# EAGLE design Brigid_control_board_v1 (EAGLE 9.6.2)
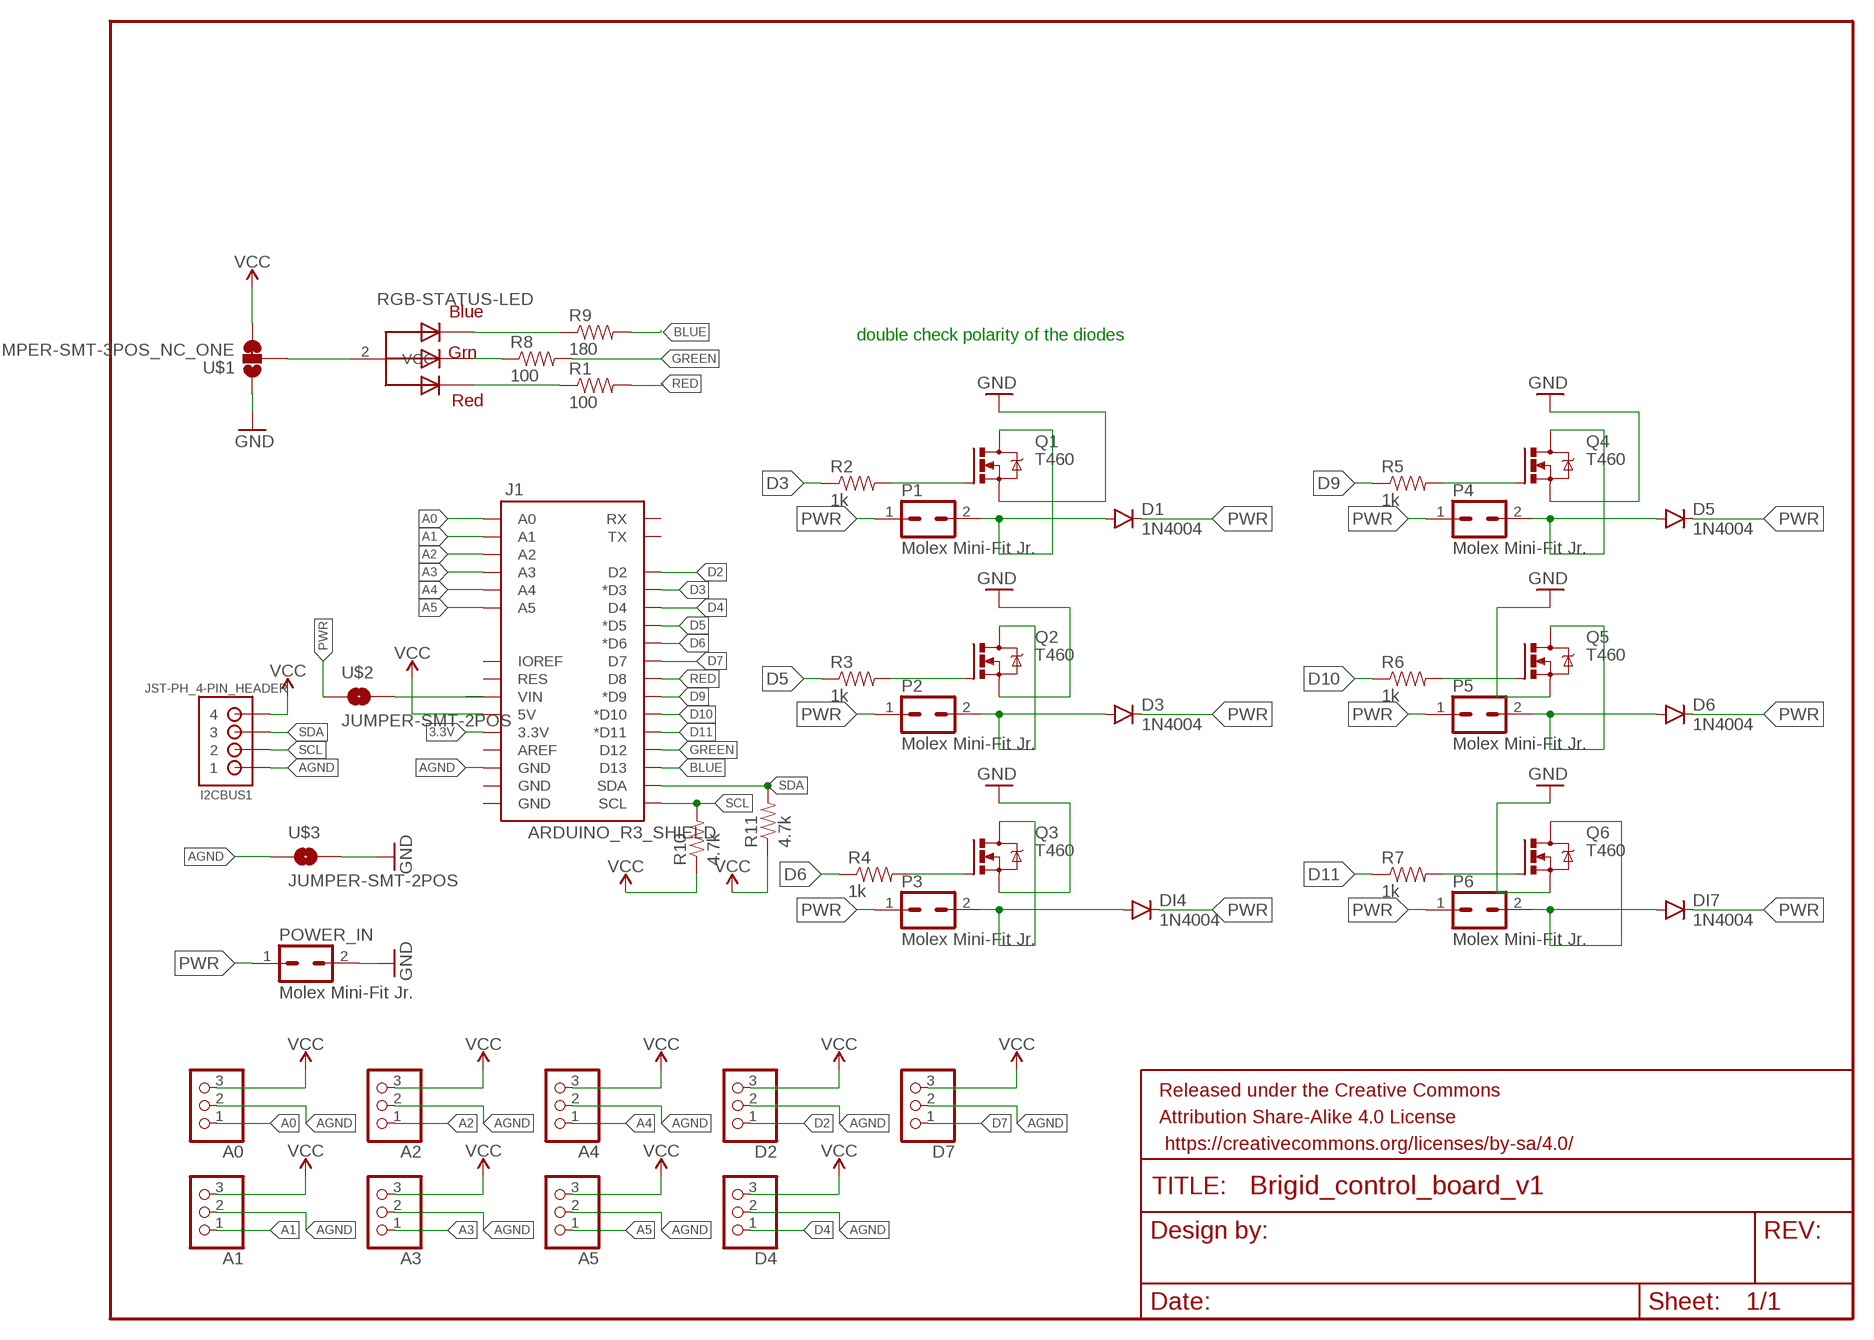
[diagram p0: schematic, sheet 1]

## Parts
A0  PINHD-1X3  [1X03]
A1  PINHD-1X3  [1X03]
A2  PINHD-1X3  [1X03]
A3  PINHD-1X3  [1X03]
A4  PINHD-1X3  [1X03]
A5  PINHD-1X3  [1X03]
D1  1N4004  DIODEPTH  [DIODE-1N4001]
D2  PINHD-1X3  [1X03]
D3  1N4004  DIODEPTH  [DIODE-1N4001]
D4  PINHD-1X3  [1X03]
D5  1N4004  DIODEPTH  [DIODE-1N4001]
D6  1N4004  DIODEPTH  [DIODE-1N4001]
D7  PINHD-1X3  [1X03]
DI4  1N4004  DIODEPTH  [DIODE-1N4001]
DI7  1N4004  DIODEPTH  [DIODE-1N4001]
FRAME1  FRAME-LETTER  [CREATIVE_COMMONS]
I2CBUS1  JST-PH_4-PIN_HEADER  [JST_B4B-PH_HEADER]
J1  ARDUINO_R3_SHIELD  [UNO_R3_SHIELD]
P1  Molex Mini-Fit Jr.  39-30-02  [39-30-?02?]
P2  Molex Mini-Fit Jr.  39-30-02  [39-30-?02?]
P3  Molex Mini-Fit Jr.  39-30-02  [39-30-?02?]
P4  Molex Mini-Fit Jr.  39-30-02  [39-30-?02?]
P5  Molex Mini-Fit Jr.  39-30-02  [39-30-?02?]
P6  Molex Mini-Fit Jr.  39-30-02  [39-30-?02?]
POWER_IN  Molex Mini-Fit Jr.  39-30-02  [39-30-?02?]
Q1  T460  IRF540  [TO220BV]
Q2  T460  IRF540  [TO220BV]
Q3  T460  IRF540  [TO220BV]
Q4  T460  IRF540  [TO220BV]
Q5  T460  IRF540  [TO220BV]
Q6  T460  IRF540  [TO220BV]
R1  100  RESISTOREZ  [AXIAL-0.3EZ]
R2  1k  RESISTOREZ  [AXIAL-0.3EZ]
R3  1k  RESISTOREZ  [AXIAL-0.3EZ]
R4  1k  RESISTOREZ  [AXIAL-0.3EZ]
R5  1k  RESISTOREZ  [AXIAL-0.3EZ]
R6  1k  RESISTOREZ  [AXIAL-0.3EZ]
R7  1k  RESISTOREZ  [AXIAL-0.3EZ]
R8  100  RESISTOREZ  [AXIAL-0.3EZ]
R9  180  RESISTOREZ  [AXIAL-0.3EZ]
R10  4.7k  RESISTOREZ  [AXIAL-0.3EZ]
R11  4.7k  RESISTOREZ  [AXIAL-0.3EZ]
RGB-STATUS-LED  RGB LED  RGBLED_CA  [LED5MMRGB]
U$1  JUMPER-SMT-3POS_NC_ONE  [SMT-JUMPER_3_1-NC_TRACE_NO-SILK]
U$2  JUMPER-SMT-2POS  [SMT-JUMPER_2_NO_NO-SILK]
U$3  JUMPER-SMT-2POS  [SMT-JUMPER_2_NO_NO-SILK]

## Nets
3.3V: J1.3.3V
A0: A0.1 J1.A0
A1: A1.1 J1.A1
A2: A2.1 J1.A2
A3: A3.1 J1.A3
A4: A4.1 J1.A4
A5: A5.1 J1.A5
AGND: A0.2 A1.2 A2.2 A3.2 A4.2 A5.2 D2.2 D4.2 D7.2 I2CBUS1.P1 J1.GND@2(GND) U$3.1
BLUE: J1.D13 R9.P$2
D2: D2.1 J1.D2
D3: J1.D3(*D3) R2.P$1
D4: D4.1 J1.D4
D5: J1.D5(*D5) R3.P$1
D6: J1.D6(*D6) R4.P$1
D7: D7.1 J1.D7
D9: J1.D9(*D9) R5.P$1
D10: J1.D10(*D10) R6.P$1
D11: J1.D11(*D11) R7.P$1
GND: POWER_IN.2 Q1.S Q2.S Q3.S Q4.S Q5.S Q6.S U$1.1 U$3.2
GREEN: J1.D12 R8.P$2
N$3: D1.A P1.2 Q1.D
N$5: R9.P$1 RGB-STATUS-LED.4(BLUE)
N$6: RGB-STATUS-LED.2(VCC) U$1.2
N$7: R1.P$1 RGB-STATUS-LED.1(RED)
N$8: R8.P$1 RGB-STATUS-LED.3(GREEN)
N$9: Q2.G R3.P$2
N$10: D3.A P2.2 Q2.D
N$11: Q1.G R2.P$2
N$12: Q3.G R4.P$2
N$13: DI4.A P3.2 Q3.D
N$15: Q4.G R5.P$2
N$16: D5.A P4.2 Q4.D
N$18: Q5.G R6.P$2
N$19: D6.A P5.2 Q5.D
N$21: Q6.G R7.P$2
N$22: DI7.A P6.2 Q6.D
PWR: D1.C D3.C D5.C D6.C DI4.C DI7.C P1.1 P2.1 P3.1 P4.1 P5.1 P6.1 POWER_IN.1 U$2.1
RED: J1.D8 R1.P$2
SCL: I2CBUS1.P2 J1.SCL R10.P$2
SDA: I2CBUS1.P3 J1.SDA R11.P$2
VCC: A0.3 A1.3 A2.3 A3.3 A4.3 A5.3 D2.3 D4.3 D7.3 I2CBUS1.P4 J1.5V R10.P$1 R11.P$1 U$1.3
VIN: J1.VIN U$2.2
Unconnected: J1.AREF J1.GND@0(GND) J1.GND@1(GND) J1.IOREF J1.RES J1.RX J1.TX

## Notes on the sheet
- double check polarity of the diodes

## Library data of the parts
A0 A1-A5 D2 D4 D7 = Connector:PINHD-1X3: PIN HEADER; CATEGORY: CONNECTOR; SUB-CATEGORY: PIN-HEADER
D1 D3 D5 D6 DI4 DI7 = SparkFun-DiscreteSemi:DIODE: Diode These are standard reverse protection diodes and small signal diodes. SMA package can handle up to about 1A. SOD-323 can handle about 200mA. What the SOD-323 package when ordering, there are some mfgs out there that are 5-pin packages.
FRAME1 = SparkFun-Aesthetics:FRAME-LETTER: Schematic Frame Standard 8.5x11 US Letter frame
I2CBUS1 = JST_connectors:JST-PH_4-PIN_HEADER: 4-pin JST PH Shrouded Header, top entry P/N B4B-PH-K-S Mating connector PHR-4 Mating cable assembly: Sparkfun PRT-09916 <http://www.sparkfun.com/products/9916>
J1 = Nathans-Arduinos2:ARDUINO_R3_SHIELD: Shield form compatible with the Arduino Uno R3.
P1-P6 POWER_IN = con-molex-mini-fit:39-30-?02?: HEADER
Q1-Q6 = transistor-power:IRF540: HEXFET Power MOSFET
R1-R11 = SparkFun-Passives:RESISTOR: Resistor Basic schematic elements and footprints for 0603, 1206, and PTH resistors.
RGB-STATUS-LED = adafruit:RGBLED_CA: RGB LED, common-anode Staggered pins http://www.ladyada.net/library/pcb/eaglelibrary.html
U$1 = nathans-custom-parts:JUMPER-SMT-3POS_NC_ONE
U$2 U$3 = nathans-custom-parts:JUMPER-SMT-2POS

## Net classes
0 default: width 0.152 mm, drill 0.305 mm, clearance 0.152 mm

## Board
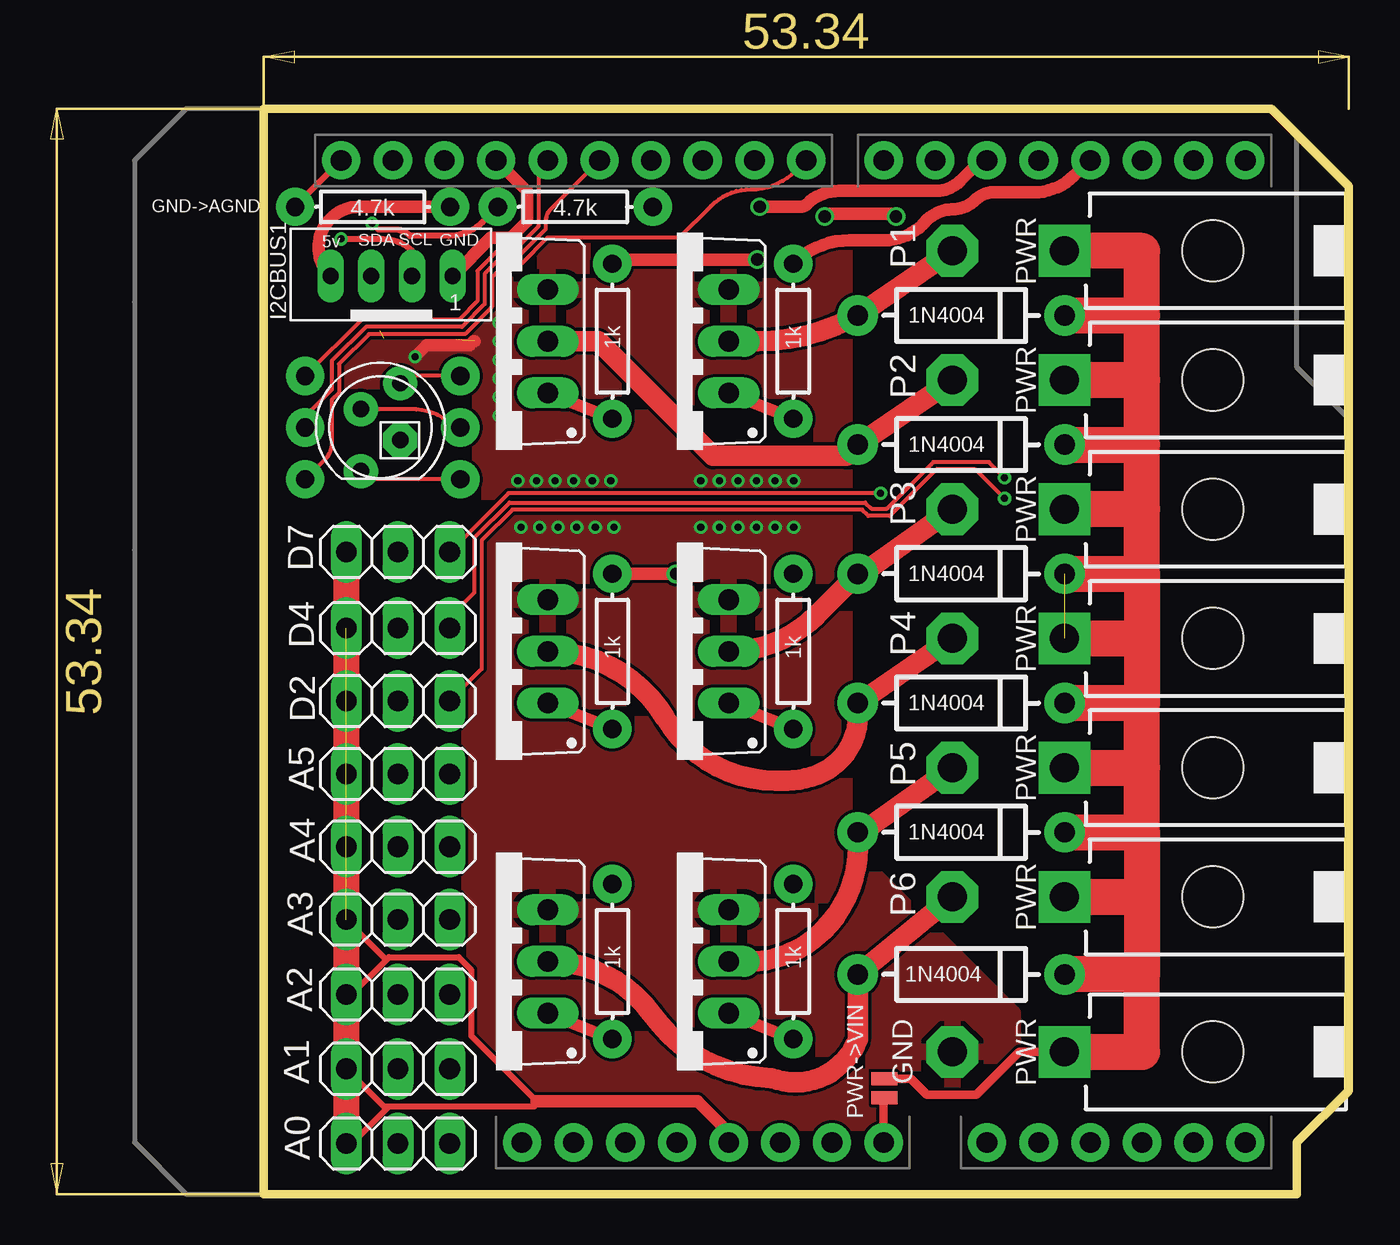
[diagram p1: board, top side]
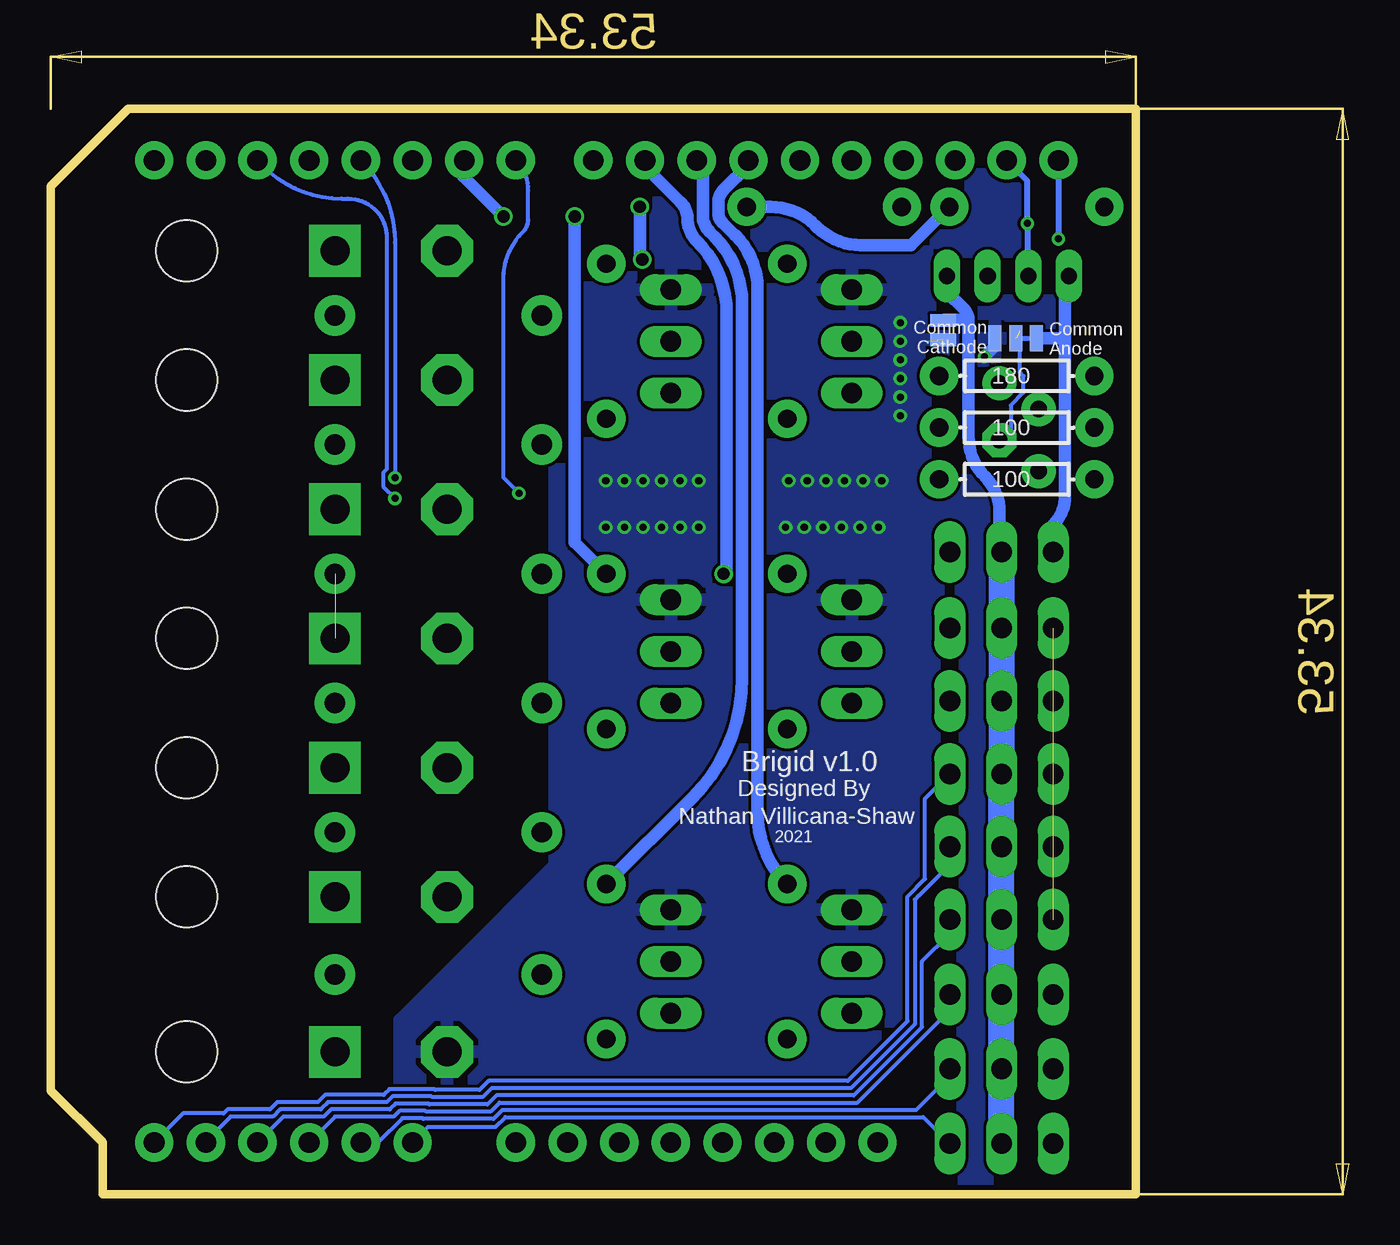
[diagram p2: board, bottom side, seen from below]

Size 53.34 x 53.34 mm. Coordinates in mm from the lower left corner, seen from the top.
Outline: 0,0 50.8,0 50.8,2.54 53.34,5.08 53.34,49.53 49.53,53.34 0,53.34 0,0
Copper layers (1*16): Top 0.035mm / dielectric 1.5mm / Bottom 0.035mm
Design rules "SeeedStudio_2layer_DRU_no_angle_20140221": minimum track width 6mil, minimum drill 12mil, track to track 6mil, track to pad 6mil, pad to pad 6mil, via to via 6mil, smd to smd 0mil, copper to edge 10mil, drill to drill 10mil, minimum pad ring 10mil, minimum via ring 6mil, stop-mask expansion 2mil, vias tented up to drill 100mil, thermal gap 10mil

### Footprints (pad centres in the part's own frame; a part is rotated, then mirrored left to right if it is on the bottom)
1X03 = drill 1.016 long: 1 -2.54,0; 2 0,0; 3 2.54,0
DIODE-1N4001 = drill 1 pad 1.981: A -5.08,0; C 5.08,0
JST_B4B-PH_HEADER = drill 0.8 long: P1 2.98,0.048; P2 0.98,0.048; P3 -1.02,0.048; P4 -3.02,0.048
UNO_R3_SHIELD = drill 1.016 pad 1.88: 3.3V 50.8,26.67; 5V 50.8,29.21; A0 50.8,41.91; A1 50.8,44.45; A2 50.8,46.99; A3 50.8,49.53; A4 50.8,52.07; A5 50.8,54.61; AREF 2.54,15.24; D2 2.54,49.53; D3 2.54,46.99; D4 2.54,44.45; D5 2.54,41.91; D6 2.54,39.37; D7 2.54,36.83; D8 2.54,33.02; D9 2.54,30.48; D10 2.54,27.94; D11 2.54,25.4; D12 2.54,22.86; D13 2.54,20.32; GND@0 50.8,31.75; GND@1 50.8,34.29; GND@2 2.54,17.78; IOREF 50.8,21.59; NC 50.8,19.05; RES 50.8,24.13; RX 2.54,54.61; SCL 2.54,10.16; SDA 2.54,12.7; TX 2.54,52.07; VIN 50.8,36.83
39-30-?02? = drill 1.422 pad 2.54 square: 1 0,0 | drill 1.422 pad 2.54 octagon: 2 0,5.512 | hole 3: 0,-7.3
TO220BV = drill 1.016 long: D 0,-2.54; G -2.54,-2.54; S 2.54,-2.54
AXIAL-0.3EZ = drill 0.9 pad 1.88: P$1 -3.81,0; P$2 3.81,0
LED5MMRGB = drill 0.8 pad 1.676: 1 -2.159,0.968; 3 0.889,0.968; 4 2.159,-0.968 | drill 0.8 pad 1.676 octagon: 2 -0.635,-0.968
SMT-JUMPER_3_1-NC_TRACE_NO-SILK = smd 0.635 x 1.27: 1 -1.016,0; 2 0,0; 3 1.016,0
SMT-JUMPER_2_NO_NO-SILK = smd 0.635 x 1.27: 1 -0.533,0; 2 0.406,0

### Placement (x,y rotation side)
A0  6.6,2.48 180 top
A1  6.6,6.16 180 top
A2  6.6,9.81 180 top
A3  6.6,13.49 180 top
A4  6.6,17.07 180 top
A5  6.6,20.65 180 top
D1  34.29,43.18 0 top
D2  6.6,24.23 180 top
D3  34.29,36.83 0 top
D4  6.6,27.81 180 top
D5  34.29,24.13 0 top
D6  34.29,17.78 0 top
D7  6.6,31.55 180 top
DI4  34.29,30.48 0 top
DI7  34.29,10.79 0 top
FRAME1  13.97,-15.24 0 top  (outside the outline)
I2CBUS1  6.31,45.07 0 top
J1  -6.35,53.34 270 top
P1  39.37,46.35 90 top
P2  39.37,40.01 90 top
P3  39.37,33.66 90 top
P4  39.37,27.3 90 top
P5  39.37,20.95 90 top
P6  39.37,14.61 90 top
POWER_IN  39.37,6.99 90 top
Q1  20.32,41.91 90 top
Q2  11.43,41.91 90 top
Q3  20.32,26.67 90 top
Q4  11.43,26.67 90 top
Q5  20.32,11.43 90 top
Q6  11.43,11.43 90 top
R1  5.85,35.13 0 bottom
R2  26.04,41.91 270 top
R3  17.14,41.91 270 top
R4  26.04,26.67 270 top
R5  17.14,26.67 270 top
R6  26.04,11.43 270 top
R7  17.14,11.43 270 top
R8  5.85,37.67 0 bottom
R9  5.85,40.21 0 bottom
R10  5.36,48.51 180 top
R11  15.32,48.51 180 top
RGB-STATUS-LED  5.75,37.69 90 top
U$1  5.91,42.05 0 bottom
U$2  30.52,5.13 270 top
U$3  9.47,42.4 270 bottom

### Tracks (layer width: path | path; a pad name or v marks a point on that pad's centre or on a via)
A0
  Bottom 0.203: J1.A0 34.8,3.3 31.48,3.3 31,3.79 10.45,3.79 A0.1
A1
  Bottom 0.203: J1.A1 37.25,2.54 36.05,3.73 35.07,3.73 35.03,3.7 31.59,3.7 31.14,4.14 10.79,4.14 9.14,5.79 A1.1
A2
  Bottom 0.203: J1.A2 39.37,3.81 36.48,3.81 36.2,4.09 34.92,4.09 34.88,4.05 31.73,4.05 31.29,4.5 13.69,4.5 9.14,9.04 A2.1
A3
  Bottom 0.203: J1.A3 41.91,3.81 39.93,3.81 39.57,4.17 36.68,4.17 36.4,4.45 34.77,4.45 34.73,4.41 31.88,4.41 31.44,4.85 13.87,4.85 10.52,8.2 10.52,11.43 9.14,12.8 A3.1
A4
  Bottom 0.203: J1.A4 45.72,2.59 44.5,3.81 42.41,3.81 42.06,4.17 40.08,4.17 39.72,4.52 36.83,4.52 36.55,4.8 34.62,4.8 34.59,4.76 32.12,4.76 31.67,5.21 14.02,5.21 10.87,8.35 10.87,14.47 10.66,14.68 10.65,14.68 9.14,16.19 A4.1
A5
  Bottom 0.203: J1.A5 46.84,3.96 44.85,3.96 44.65,4.17 42.56,4.17 42.2,4.52 40.22,4.52 39.87,4.88 36.97,4.88 36.69,5.16 34.48,5.16 34.44,5.12 32.26,5.12 31.82,5.56 14.16,5.56 11.23,8.5 11.23,14.62 10.36,15.48 10.36,19.43 A5.1
AGND
  Top 0.61: I2CBUS1.P1 11.17,46.99 12.14,46.99 12.95,47.8 12.95,49.28 J1.GND@2
  Bottom 0.61: I2CBUS1.P1 9.29,44.33 8.44,43.48 arc45 8.23,42.98 | 8.23,42.98 8.23,37.23 arc-45 7.41,35.25 arc45 6.71,33.55 6.71,31.65 D7.2 | U$3.1 9.42,42.98 8.23,42.98
  Bottom 1.27: A0.2 A1.2 A2.2 A3.2 A4.2 A5.2 D2.2 D4.2 D7.2
BLUE
  Top 0.203: J1.D13 13.51,50.34 13.51,47.57 12.38,46.43 11.58,46.43 10.52,45.37 10.52,43.89 9.6,42.98 4.81,42.98 R9.P$2
D2  (via drill 0.35)
  Top 0.203: D2.1 10.72,25.81 10.72,32.12 12.23,33.63 29.42,33.63 29.72,33.33 30.78,33.33 33.07,35.61 35,35.61 v36.42,34.19
  Bottom 0.203: J1.D2 42.89,50.51 arc-45 39.05,48.92 38.73,48.92 arc90 36.83,47.02 36.83,35.62 37.01,35.45 37.01,34.77 v36.42,34.19
D3
  Top 0.61: R2.P$1 arc-45 28.82,46.87 30.51,46.87 arc45 32.4,47.66 32.64,47.9 arc-45 33.83,48.39 arc45 35.03,48.88 arc-45 35.85,49.23 37.85,49.23 arc45 39.84,50.05 40.59,50.8 J1.D3
D4  (via drill 0.35)
  Top 0.203: D4.1 9.14,28.35 10.36,29.57 10.36,32.27 12.08,33.98 29.57,33.98 29.87,33.68 30.63,33.68 32.92,35.97 35.66,35.97 v36.42,35.2
  Bottom 0.203: J1.D4 arc45 36.42,46.75 v36.42,35.2
D5  (via drill 0.6)
  Top 0.61: R3.P$1 17.35,45.92 v24.26,45.92 | J1.D5 35.26,50.8 34.23,49.77 arc-45 33.09,49.3 28.27,49.3 arc45 26.71,48.65 arc-45 26.38,48.52 v24.38,48.52
  Bottom 0.61: v24.38,48.52 24.38,46.05 v24.26,45.92
D6  (via drill 0.6)
  Top 0.61: v27.58,48.04 27.73,48.18 31.09,48.18 v31.09,48.04
  Bottom 0.61: R4.P$1 27.58,32.03 v27.58,48.04 | J1.D6 33.07,50.75 33.07,50.02 v31.09,48.04
D7  (via drill 0.35)
  Top 0.203: D7.1 12.04,34.44 v30.33,34.44
  Bottom 0.203: J1.D7 arc45 29.87,49.33 29.87,47.9 arc45 30.12,47.3 arc-45 31.09,44.96 31.09,35.2 v30.33,34.44
D9  (via drill 0.6)
  Top 0.61: R5.P$1 v20.27,30.48
  Bottom 0.61: v20.27,30.48 20.12,30.63 20.12,43.28 arc-45 21.59,46.85 arc45 22.05,47.94 arc-45 22.38,48.74 24.13,50.49 J1.D9
D10
  Bottom 0.61: R6.P$1 21.8,19.47 arc-45 19.36,25.38 19.36,43.76 arc-45 20.72,47.06 20.95,47.29 arc45 21.29,48.09 21.29,50.49 J1.D10
D11
  Bottom 0.61: J1.D11 19.05,50.57 20.27,49.34 arc-45 20.52,48.74 20.52,48.21 arc-45 20.33,47.74 19.7,47.12 19.68,47.12 arc45 18.59,44.48 18.59,18.73 arc-45 R7.P$1
GND  (via drill 0.35)  (1 unrouted)
  Top 0.61: v7.45,41.15 8,41.71 10.13,41.71 10.33,41.91 10.36,41.91
  Bottom 0.61: U$1.1 6.92,41.67 v7.45,41.15
  other vias: 12.65,32.77 13.56,32.77 14.48,32.77 15.39,32.77 16.31,32.77 17.22,32.77 21.49,32.77 22.4,32.77 23.32,32.77 24.23,32.77 25.15,32.77 26.06,32.77 21.49,35.05 22.4,35.05 23.32,35.05 24.23,35.05 25.15,35.05 26.06,35.05 15.24,35.05 16.15,35.05 17.07,35.05 12.5,35.05 13.41,35.05 14.33,35.05 11.58,41 11.58,41.91 11.58,42.82 11.58,38.25 11.58,39.17 11.58,40.08
  pour Bottom: 0,53.34 0,0 31.75,0 36.2,4.45 36.2,8.57 28.57,16.19 28.57,53.34
  pour Top: 0,0 36.83,0 36.83,8.89 28.55,17.17 28.55,53.34 0,53.34
GREEN
  Top 0.203: J1.D12 14.12,48.41 arc45 13.87,47.81 13.87,47.42 12.52,46.08 11.73,46.08 10.87,45.22 10.87,43.74 9.75,42.62 5.03,42.62 3.35,40.95 3.35,39.53 2.04,38.23 R8.P$2
N$3
  Top 1.016: P1.2 D1.A 28.83,42.99 arc-27 24.25,41.91 Q1.D
N$5
  Top 0.203: R9.P$1 7.08,40.21 RGB-STATUS-LED.4
N$6  (1 unrouted)
  Bottom 0.203: RGB-STATUS-LED.2 6.16,37.61 6.16,38.76 5.52,39.39 5.52,40.2 5.71,40.38 5.71,42.43
N$7
  Top 0.203: R1.P$1 5.18,35.13 RGB-STATUS-LED.1
N$8
  Top 0.203: R8.P$1 9.42,37.67 arc45 7.23,38.58 RGB-STATUS-LED.3
N$9
  Top 0.61: R3.P$2 Q2.G
N$10
  Top 1.016: P2.2 D3.A 28.65,36.27 22.1,36.27 16.46,41.91 Q2.D
N$11
  Top 0.61: Q1.G R2.P$2
N$12
  Top 0.61: R4.P$2 Q3.G
N$13
  Top 1.016: P3.2 29.84,30.8 DI4.A 27.2,28.47 arc-45 Q3.D
N$15
  Top 0.61: R5.P$2 Q4.G
N$16
  Top 1.016: P4.2 D5.A 29.21,23.48 arc-63 27.52,20.74 arc-27 25.72,20.32 25.18,20.32 arc-59 19.74,23.4 arc59 Q4.D
N$18
  Top 0.61: R6.P$2 Q5.G
N$19
  Top 1.016: P5.2 29.84,18.1 D6.A 29.21,17.01 arc-56 26.68,12.28 arc-34 23.86,11.43 Q5.D
N$21
  Top 0.61: R7.P$2 Q6.G
N$22
  Top 1.016: P6.2 DI7.A 29.21,7.62 arc-90 24.96,5.7 arc-53 19.05,8.89 arc53 Q6.D
PWR  (1 unrouted)
  Top 0.406: U$2.1 31.83,5.66 32.61,4.88 35.05,4.88 37.16,6.99 POWER_IN.1
  Top 1.778: POWER_IN.1 43.18,6.99 43.18,10.79 | 43.18,10.79 DI7.C | 43.18,14.61 P6.1 43.18,14.59 | D6.C 43.18,17.78 | 43.18,17.78 43.18,14.59 | 43.18,14.59 43.18,10.79 | P5.1 43.18,20.95 | 43.18,20.95 43.18,24.13 | 43.18,24.13 D5.C | P4.1 43.18,27.3 | DI4.C 43.18,30.48 | 43.18,30.48 43.18,33.66 | 43.18,33.66 P3.1 | D3.C 43.18,36.83 | 43.18,36.83 43.18,40.01 | 43.18,40.01 P2.1 | D1.C 43.18,43.18 | 43.18,43.18 43.18,46.35 P1.1 | 43.18,17.78 43.18,20.95 | 43.18,30.48 43.18,24.13 | 43.18,33.66 43.18,36.83 | 43.18,40.01 43.18,43.18
RED
  Top 0.203: R1.P$2 3,36.09 arc45 3.35,36.93 3.35,39.03 3.71,39.39 3.71,40.8 5.18,42.27 9.9,42.27 11.23,43.6 11.23,45.06 11.89,45.72 12.67,45.72 13.94,46.99 20.42,46.99 21.99,48.55 arc-45 23.97,49.38 arc45 26.15,50.28 J1.D8
SCL  (via drill 0.35)
  Top 0.305: R10.P$2 1.55,48.54 J1.SCL | v3.81,46.94 5.88,46.94 arc-45 7.29,46.36 I2CBUS1.P2
  Bottom 0.305: J1.SCL v3.81,46.94
SDA  (via drill 0.35)
  Top 0.305: R11.P$2 10.78,47.79 arc-45 9.09,47.09 7.2,47.09 arc45 6.46,47.4 5.64,47.4 v5.33,47.7
  Bottom 0.305: I2CBUS1.P3 5.33,45.16 v5.33,47.7 5.33,49.78 J1.SDA
VCC  (4 unrouted)
  Top 0.305: A0.3 4.33,2.48 6.16,4.31 | 6.16,4.31 13.3,4.31 13.56,4.57 13.41,4.57 10.21,7.77 10.21,11.02 9.59,11.64 6.16,11.64 6.02,11.5 | A1.3 5.91,4.31 6.16,4.31 | A2.3 4.33,9.81 6.02,11.5 | A3.3 6.02,11.53 6.02,11.5
  Top 0.61: R10.P$1 4.67,48.51 arc45 3.29,47.94 arc90 I2CBUS1.P4 | I2CBUS1.P4 | J1.5V 22.86,3.05 21.34,4.57 13.41,4.57
  Top 1.27: D7.3 A0.3
  Bottom 0.61: D7.3 4.06,32.89 arc-45 3.48,34.29 3.48,42.06 | I2CBUS1.P4 3.48,44.92 3.48,42.06 | U$1.3 4.88,42.06 3.48,42.06 | R10.P$1 11.05,46.63 13.53,46.63 arc45 15.67,47.52 15.75,47.6 arc-45 17.96,48.51 R11.P$1
VIN
  Top 0.406: J1.VIN 30.48,4.68 U$2.2

### Text on the board
tNames: GND->AGND | 5v | SDA | SCL | GND | PWR | PWR | PWR | PWR | PWR | PWR | GND | PWR | PWR->VIN
bNames: Common / Cathode | Common / Anode | Brigid v1.0 | Designed By | Nathan Villicana-Shaw | 2021